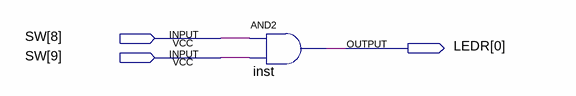
[diagram p0: schematic sheet]
// Quartus schematic GateDemo.bdf as structural Verilog: 1 symbols, 3 pins
module GateDemo (
  input  [9:8] SW,
  output [0:0] LEDR
);

  and inst (LEDR[0], SW[8], SW[9]);
endmodule
